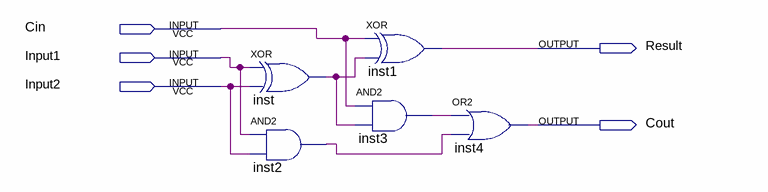
[diagram p0: schematic sheet]
// Quartus schematic fulladder2_1bit.bdf as structural Verilog: 5 symbols, 5 pins
module fulladder2_1bit (
  input  Cin,
  input  Input1,
  input  Input2,
  output Result,
  output Cout
);

  wire inst2_out, inst3_out, inst_out;

  xor inst (inst_out, Input1, Input2);
  and inst2 (inst2_out, Input1, Input2);
  xor inst1 (Result, Cin, inst_out);
  and inst3 (inst3_out, Cin, inst_out);
  or inst4 (Cout, inst3_out, inst2_out);
endmodule
